# Altium schematic sheet BMS.SchDoc: =Battery System
size B; SheetNumber: 2
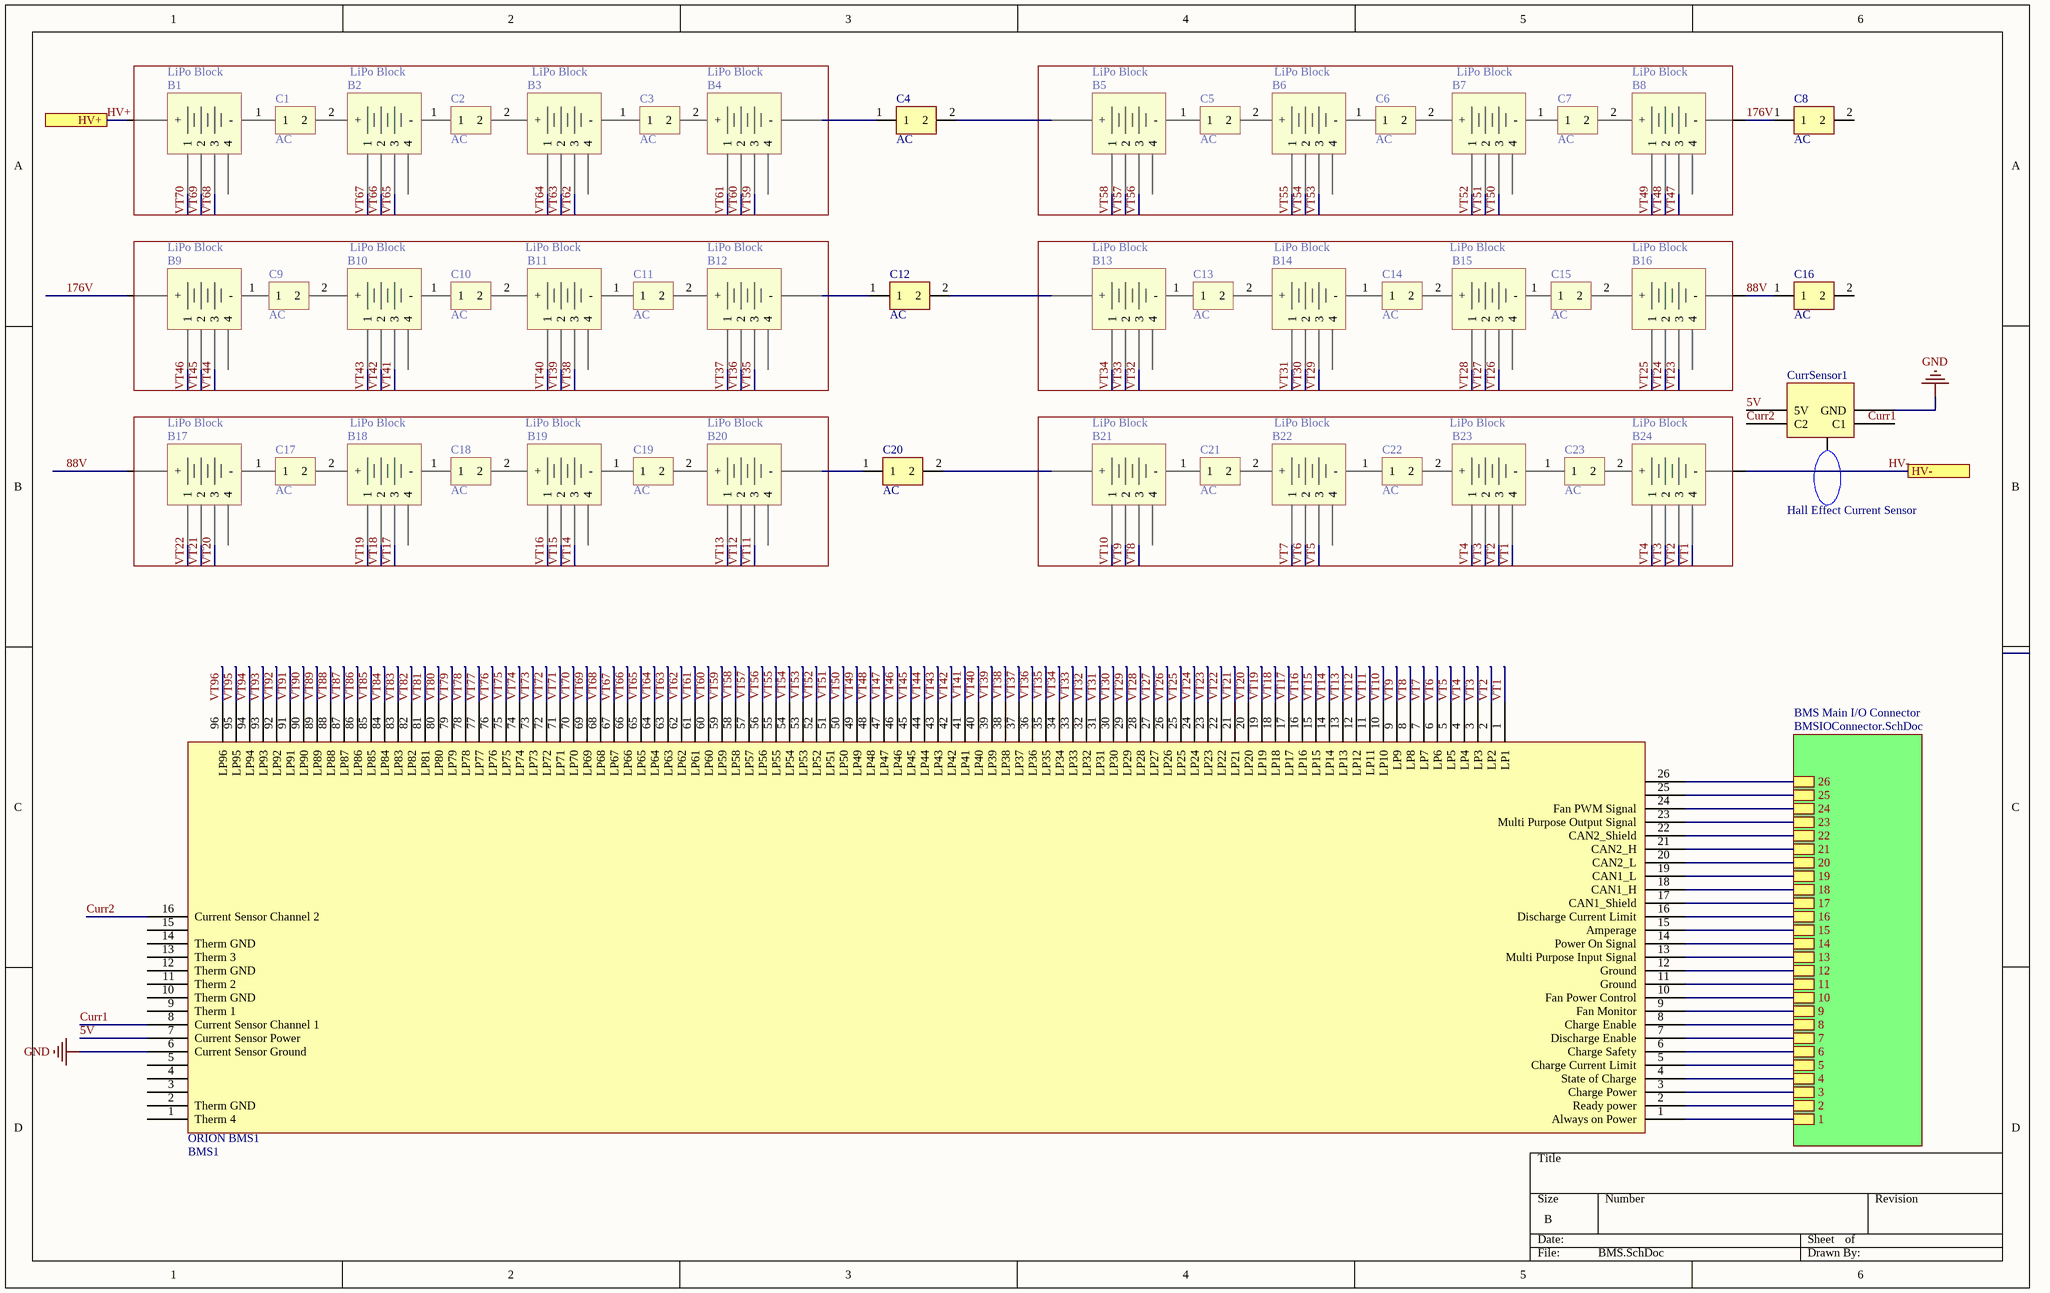
[diagram p0: BMS.SchDoc]

## Parts
B1  LiPo Block
B2  LiPo Block
B3  LiPo Block
B4  LiPo Block
B5  LiPo Block
B6  LiPo Block
B7  LiPo Block
B8  LiPo Block
B9  LiPo Block
B10  LiPo Block
B11  LiPo Block
B12  LiPo Block
B13  LiPo Block
B14  LiPo Block
B15  LiPo Block
B16  LiPo Block
B17  LiPo Block
B18  LiPo Block
B19  LiPo Block
B20  LiPo Block
B21  LiPo Block
B22  LiPo Block
B23  LiPo Block
B24  LiPo Block
C1  AC
C2  AC
C3  AC
C4  AC
C5  AC
C6  AC
C7  AC
C8  AC
C9  AC
C10  AC
C11  AC
C12  AC
C13  AC
C14  AC
C15  AC
C16  AC
C17  AC
C18  AC
C19  AC
C20  AC
C21  AC
C22  AC
C23  AC
CurrSensor1  Hall Effect Current Sensor
ORION_BMS1  BMS1

## Sub-sheets
BMS Main I/O Connector = BMSIOConnector.SchDoc: 26, 25, 24, 23, 22, 21, 20, 19, 18, 17, 16, 15, 14, 13, 12, 11, 10, 9, 8, 7, 6, 5, 4, 3, 2, 1

## Ports
HV+, HV-

## Nets
GND: CurrSensor1.2(GND) ORION_BMS1.6(Current_Sensor_Ground)
5V: CurrSensor1.3(5V) ORION_BMS1.7(Current_Sensor_Power)
88V: B16.6(-) B17.5(+) C16.1
176V: B8.6(-) B9.5(+) C8.1
Curr1: ORION_BMS1.8(Current_Sensor_Channel_1)
Curr2: CurrSensor1.4(C2) ORION_BMS1.16(Current_Sensor_Channel_2)
HV+: B1.5(+) ; port HV+
HV-: B24.6(-) ; port HV-
VT1: B23.4 B24.4 ORION_BMS1.1(LP1)
VT2: B23.3 B24.3 ORION_BMS1.2(LP2)
VT3: B23.2 B24.2 ORION_BMS1.3(LP3)
VT4: B23.1 B24.1 ORION_BMS1.4(LP4)
VT5: B22.3 ORION_BMS1.5(LP5)
VT6: B22.2 ORION_BMS1.6(LP6)
VT7: B22.1 ORION_BMS1.7(LP7)
VT8: B21.3 ORION_BMS1.8(LP8)
VT9: B21.2 ORION_BMS1.9(LP9)
VT10: B21.1 ORION_BMS1.10(LP10)
VT11: B20.3 ORION_BMS1.11(LP11)
VT12: B20.2 ORION_BMS1.12(LP12)
VT13: B20.1 ORION_BMS1.13(LP13)
VT14: B19.3 ORION_BMS1.14(LP14)
VT15: B19.2 ORION_BMS1.15(LP15)
VT16: B19.1 ORION_BMS1.16(LP16)
VT17: B18.3 ORION_BMS1.17(LP17)
VT18: B18.2 ORION_BMS1.18(LP18)
VT19: B18.1 ORION_BMS1.19(LP19)
VT20: B17.3 ORION_BMS1.20(LP20)
VT21: B17.2 ORION_BMS1.21(LP21)
VT22: B17.1 ORION_BMS1.22(LP22)
VT23: B16.3 ORION_BMS1.23(LP23)
VT24: B16.2 ORION_BMS1.24(LP24)
VT25: B16.1 ORION_BMS1.25(LP25)
VT26: B15.3 ORION_BMS1.26(LP26)
VT27: B15.2 ORION_BMS1.27(LP27)
VT28: B15.1 ORION_BMS1.28(LP28)
VT29: B14.3 ORION_BMS1.29(LP29)
VT30: B14.2 ORION_BMS1.30(LP30)
VT31: B14.1 ORION_BMS1.31(LP31)
VT32: B13.3 ORION_BMS1.32(LP32)
VT33: B13.2 ORION_BMS1.33(LP33)
VT34: B13.1 ORION_BMS1.34(LP34)
VT35: B12.3 ORION_BMS1.35(LP35)
VT36: B12.2 ORION_BMS1.36(LP36)
VT37: B12.1 ORION_BMS1.37(LP37)
VT38: B11.3 ORION_BMS1.38(LP38)
VT39: B11.2 ORION_BMS1.39(LP39)
VT40: B11.1 ORION_BMS1.40(LP40)
VT41: B10.3 ORION_BMS1.41(LP41)
VT42: B10.2 ORION_BMS1.42(LP42)
VT43: B10.1 ORION_BMS1.43(LP43)
VT44: B9.3 ORION_BMS1.44(LP44)
VT45: B9.2 ORION_BMS1.45(LP45)
VT46: B9.1 ORION_BMS1.46(LP46)
VT47: B8.3 ORION_BMS1.47(LP47)
VT48: B8.2 ORION_BMS1.48(LP48)
VT49: B8.1 ORION_BMS1.49(LP49)
VT50: B7.3 ORION_BMS1.50(LP50)
VT51: B7.2 ORION_BMS1.51(LP51)
VT52: B7.1 ORION_BMS1.52(LP52)
VT53: B6.3 ORION_BMS1.53(LP53)
VT54: B6.2 ORION_BMS1.54(LP54)
VT55: B6.1 ORION_BMS1.55(LP55)
VT56: B5.3 ORION_BMS1.56(LP56)
VT57: B5.2 ORION_BMS1.57(LP57)
VT58: B5.1 ORION_BMS1.58(LP58)
VT59: B4.3 ORION_BMS1.59(LP59)
VT60: B4.2 ORION_BMS1.60(LP60)
VT61: B4.1 ORION_BMS1.61(LP61)
VT62: B3.3 ORION_BMS1.62(LP62)
VT63: B3.2 ORION_BMS1.63(LP63)
VT64: B3.1 ORION_BMS1.64(LP64)
VT65: B2.3 ORION_BMS1.65(LP65)
VT66: B2.2 ORION_BMS1.66(LP66)
VT67: B2.1 ORION_BMS1.67(LP67)
VT68: B1.3 ORION_BMS1.68(LP68)
VT69: B1.2 ORION_BMS1.69(LP69)
VT70: B1.1 ORION_BMS1.70(LP70)
VT71: ORION_BMS1.71(LP71)
VT72: ORION_BMS1.72(LP72)
VT73: ORION_BMS1.73(LP73)
VT74: ORION_BMS1.74(LP74)
VT75: ORION_BMS1.75(LP75)
VT76: ORION_BMS1.76(LP76)
VT77: ORION_BMS1.77(LP77)
VT78: ORION_BMS1.78(LP78)
VT79: ORION_BMS1.79(LP79)
VT80: ORION_BMS1.80(LP80)
VT81: ORION_BMS1.81(LP81)
VT82: ORION_BMS1.82(LP82)
VT83: ORION_BMS1.83(LP83)
VT84: ORION_BMS1.84(LP84)
VT85: ORION_BMS1.85(LP85)
VT86: ORION_BMS1.86(LP86)
VT87: ORION_BMS1.87(LP87)
VT88: ORION_BMS1.88(LP88)
VT89: ORION_BMS1.89(LP89)
VT90: ORION_BMS1.90(LP90)
VT91: ORION_BMS1.91(LP91)
VT92: ORION_BMS1.92(LP92)
VT93: ORION_BMS1.93(LP93)
VT94: ORION_BMS1.94(LP94)
VT95: ORION_BMS1.95(LP95)
VT96: ORION_BMS1.96(LP96)
NetB4_6: B4.6(-) C4.1
NetB5_5: B5.5(+) C4.2
NetB12_6: B12.6(-) C12.1
NetB13_5: B13.5(+) C12.2
NetB20_6: B20.6(-) C20.1
NetB21_5: B21.5(+) C20.2
NetORION_BMS1_1: ORION_BMS1.1(Therm_4) ; sheet BMS Main I/O Connector/1
NetORION_BMS1_2: ORION_BMS1.2(Therm_GND) ; sheet BMS Main I/O Connector/2
NetORION_BMS1_3: ORION_BMS1.3 ; sheet BMS Main I/O Connector/3
NetORION_BMS1_4: ORION_BMS1.4 ; sheet BMS Main I/O Connector/4
NetORION_BMS1_5: ORION_BMS1.5 ; sheet BMS Main I/O Connector/5
NetORION_BMS1_6: ORION_BMS1.6(Charge_Safety) ; sheet BMS Main I/O Connector/6
NetORION_BMS1_7: ORION_BMS1.7(Discharge_Enable) ; sheet BMS Main I/O Connector/7
NetORION_BMS1_8: ORION_BMS1.8(Charge_Enable) ; sheet BMS Main I/O Connector/8
NetORION_BMS1_9: ORION_BMS1.9(Therm_1) ; sheet BMS Main I/O Connector/9
NetORION_BMS1_10: ORION_BMS1.10(Therm_GND) ; sheet BMS Main I/O Connector/10
NetORION_BMS1_11: ORION_BMS1.11(Therm_2) ; sheet BMS Main I/O Connector/11
NetORION_BMS1_12: ORION_BMS1.12(Therm_GND) ; sheet BMS Main I/O Connector/12
NetORION_BMS1_13: ORION_BMS1.13(Therm_3) ; sheet BMS Main I/O Connector/13
NetORION_BMS1_14: ORION_BMS1.14(Therm_GND) ; sheet BMS Main I/O Connector/14
NetORION_BMS1_15: ORION_BMS1.15 ; sheet BMS Main I/O Connector/15
NetORION_BMS1_16: ORION_BMS1.16(Discharge_Current_Limit) ; sheet BMS Main I/O Connector/16
NetORION_BMS1_17: ORION_BMS1.17(CAN1_Shield) ; sheet BMS Main I/O Connector/17
NetORION_BMS1_18: ORION_BMS1.18(CAN1_H) ; sheet BMS Main I/O Connector/18
NetORION_BMS1_19: ORION_BMS1.19(CAN1_L) ; sheet BMS Main I/O Connector/19
NetORION_BMS1_20: ORION_BMS1.20(CAN2_L) ; sheet BMS Main I/O Connector/20
NetORION_BMS1_21: ORION_BMS1.21(CAN2_H) ; sheet BMS Main I/O Connector/21
NetORION_BMS1_22: ORION_BMS1.22(CAN2_Shield) ; sheet BMS Main I/O Connector/22
NetORION_BMS1_23: ORION_BMS1.23(Multi_Purpose_Output_Signal) ; sheet BMS Main I/O Connector/23
NetORION_BMS1_24: ORION_BMS1.24(Fan_PWM_Signal) ; sheet BMS Main I/O Connector/24
NetORION_BMS1_25: ORION_BMS1.25 ; sheet BMS Main I/O Connector/25
NetORION_BMS1_26: ORION_BMS1.26 ; sheet BMS Main I/O Connector/26

Not connected (* = marked no-connect by the designer): B1 4 6(-); B2 4 5(+) 6(-); B3 4 5(+) 6(-); B4 4 5(+); B5 4 6(-); B6 4 5(+) 6(-); B7 4 5(+) 6(-); B8 4 5(+); B9 4 6(-); B10 4 5(+) 6(-); B11 4 5(+) 6(-); B12 4 5(+); B13 4 6(-); B14 4 5(+) 6(-); B15 4 5(+) 6(-); B16 4 5(+); B17 4 6(-); B18 4 5(+) 6(-); B19 4 5(+) 6(-); B20 4 5(+); B21 4 6(-); B22 4 5(+) 6(-); B23 5(+) 6(-); B24 5(+); C1 1 2; C2 1 2; C3 1 2; C5 1 2; C6 1 2; C7 1 2; C8 2; C9 1 2; C10 1 2; C11 1 2; C13 1 2; C14 1 2; C15 1 2; C16 2; C17 1 2; C18 1 2; C19 1 2; C21 1 2; C22 1 2; C23 1 2; CurrSensor1 1(C1)

## Notes on the sheet
- Labels drawn without touching a wire or pin: Curr1

## Library data of the parts
B1-B24 = Li-Ion Cell
C1-C23 = Anderson Connector
ORION_BMS1 = ORION BMS